# Altium schematic sheet DelSolClock.SchDoc
size A4
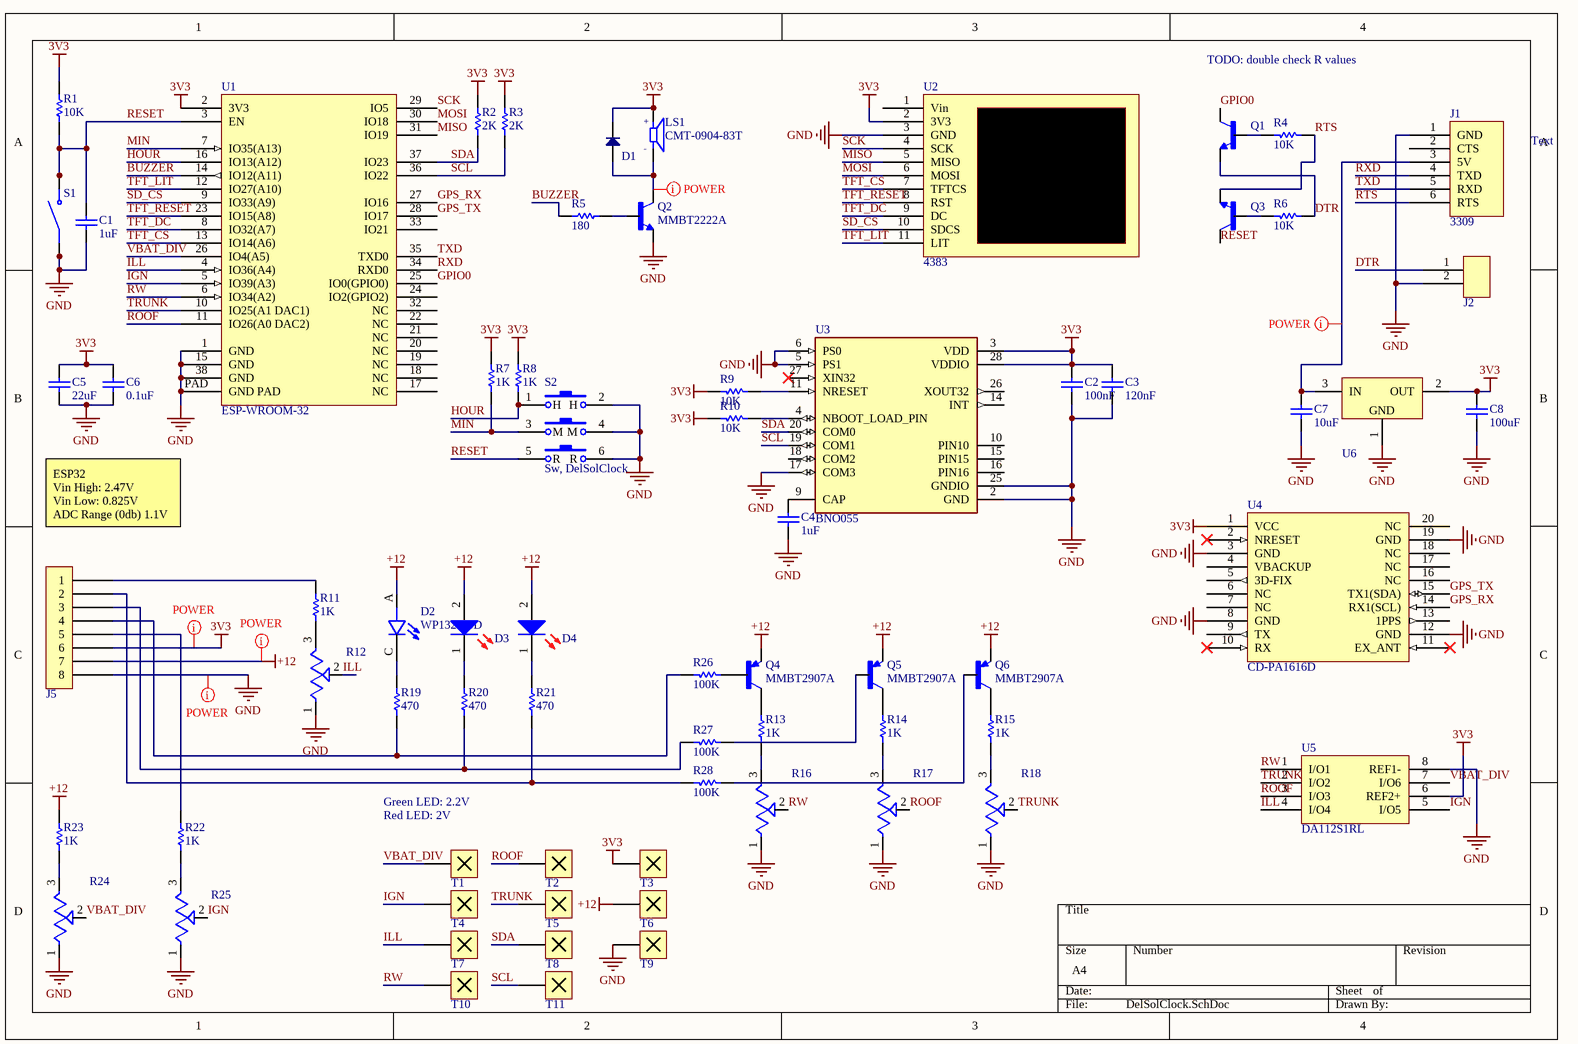
[diagram p0: DelSolClock.SchDoc]

## Parts
C1  value 1uF  [0805 HD - Long]  (hidden comment: CL21B105KOFNNNG)
C2  value 100nF  [0805 HD - Long]  (hidden comment: CL21B104KBCNFNC)
C3  value 120nF  [0805 HD - Long]  (hidden comment: CC0805KRX7R9BB124)
C4  value 1uF  [0805 HD - Long]  (hidden comment: CL21B105KOFNNNG)
C5  value 22uF  [0805 HD - Long]  (hidden comment: Cap)
C6  value 0.1uF  [0805 HD - Long]  (hidden comment: Cap)
C7  value 10uF  [0805 HD - Long]  (hidden comment: Cap)
C8  value 100uF  [0805 HD - Long]  (hidden comment: Cap)
D1  SD0805S020S1R0  [0805 HD - Polarized]  (value not drawn)
D2  WP132XGD  [LEDRD254W50D405H1055]
D3  SSL-LX4673ID-LA20  [LED, SSL-LX4673ID-LA20]  (value not drawn)
D4  SSL-LX4673ID-LA20  [LED, SSL-LX4673ID-LA20]  (value not drawn)
J1  3309  [Conn, 3309]
J2  90120-0122  [CONN, HEADER, 2x1 0.1 Pitch Unshrouded]  (value not drawn)
J5  68000-408HLF  [Conn, Header, 8x1 0.1 Pitch Unshrouded]  (value not drawn)
LS1  CMT-0904-83T  [XDCR_CMT-0904-83T]
Q1  MMBT2222A  [SOT23]  (value not drawn)
Q2  MMBT2222A  [SOT23]
Q3  MMBT2222A  [SOT23]  (value not drawn)
Q4  MMBT2907A  [TRANS_MMBT2907A]
Q5  MMBT2907A  [TRANS_MMBT2907A]
Q6  MMBT2907A  [TRANS_MMBT2907A]
R1  value 10K  [0805 HD - Long]  (hidden comment: RNCP0805FTD10K0)
R2  value 2K  [0805 HD - Long]  (hidden comment: AC0805FR-7W2KL)
R3  value 2K  [0805 HD - Long]  (hidden comment: AC0805FR-7W2KL)
R4  value 10K  [0805 HD - Long]  (hidden comment: RNCP0805FTD10K0)
R5  value 180  [0805 HD - Long]  (hidden comment: ESR10EZPJ181)
R6  value 10K  [0805 HD - Long]  (hidden comment: RNCP0805FTD10K0)
R7  value 1K  [0805 HD - Long]  (hidden comment: CRGH0805J1K0)
R8  value 1K  [0805 HD - Long]  (hidden comment: CRGH0805J1K0)
R9  value 10K  [0805 HD - Long]  (hidden comment: RNCP0805FTD10K0)
R10  value 10K  [0805 HD - Long]  (hidden comment: RNCP0805FTD10K0)
R11  value 1K  [0805 HD - Long]  (hidden comment: CRGH0805J1K0)
R12  PVG3G104C01R00  [TRIM_PVG3G104C01R00]  (value not drawn)
R13  value 1K  [0805 HD - Long]  (hidden comment: CRGH0805J1K0)
R14  value 1K  [0805 HD - Long]  (hidden comment: CRGH0805J1K0)
R15  value 1K  [0805 HD - Long]  (hidden comment: CRGH0805J1K0)
R16  PVG3G104C01R00  [TRIM_PVG3G104C01R00]  (value not drawn)
R17  PVG3G104C01R00  [TRIM_PVG3G104C01R00]  (value not drawn)
R18  PVG3G104C01R00  [TRIM_PVG3G104C01R00]  (value not drawn)
R19  value 470  [0805 HD - Long]  (hidden comment: ESR10EZPJ471)
R20  value 470  [0805 HD - Long]  (hidden comment: ESR10EZPJ471)
R21  value 470  [0805 HD - Long]  (hidden comment: ESR10EZPJ471)
R22  value 1K  [0805 HD - Long]  (hidden comment: CRGH0805J1K0)
R23  value 1K  [0805 HD - Long]  (hidden comment: CRGH0805J1K0)
R24  PVG3G104C01R00  [TRIM_PVG3G104C01R00]  (value not drawn)
R25  PVG3G104C01R00  [TRIM_PVG3G104C01R00]  (value not drawn)
R26  value 100K  [0805 HD - Long]  (hidden comment: CRGH0805J100K)
R27  value 100K  [0805 HD - Long]  (hidden comment: CRGH0805J100K)
R28  value 100K  [0805 HD - Long]  (hidden comment: CRGH0805J100K)
S1  8-1437565-0  [SW_8-1437565-0]  (value not drawn)
S2  Sw, DelSolClock  [Sw, DelSolClock]
T1  Test Point  [5002 Test Point]  (value not drawn)
T2  Test Point  [5002 Test Point]  (value not drawn)
T3  Test Point  [5002 Test Point]  (value not drawn)
T4  Test Point  [5002 Test Point]  (value not drawn)
T5  Test Point  [5002 Test Point]  (value not drawn)
T6  Test Point  [5002 Test Point]  (value not drawn)
T7  Test Point  [5002 Test Point]  (value not drawn)
T8  Test Point  [5002 Test Point]  (value not drawn)
T9  Test Point  [5002 Test Point]  (value not drawn)
T10  Test Point  [5002 Test Point]  (value not drawn)
T11  Test Point  [5002 Test Point]  (value not drawn)
U1  ESP-WROOM-32  [MODULE, ESP32-WROOM-32]
U2  4383  [Module, Adafruit TFT]
U3  BNO055  [LGA28R50P4X10_380X520X100]
U4  CD-PA1616D  [Module, CD-PA1616D]
U5  DA112S1RL  [IC, DA112S1RL]
U6  TLV1117-33CDCYR  [SOT230P700X180-4N Regulator 3.3V 800mA]  (value not drawn)

## Nets
3V3: C2.1 C3.1 C5.2 C6.2 C8.2 D1.1(C) J5.6 LS1.P R1.2 R2.2 R3.2 R7.2 R8.2 R9.1 R10.1 T3.1 U1.2(3V3) U2.2(3V3) U3.3(VDD) U3.28(VDDIO) U4.1(VCC) U5.6(REF2+) U6.2(OUT)
+12: D2.A D3.2(A) D4.2(A) J5.7 Q4.2(E) Q5.2(E) Q6.2(E) R23.1 T6.1
GND: C1.1 C2.2 C3.2 C4.1 C5.1 C6.1 C7.1 C8.1 J1.1(GND) J2.2 J5.8 Q2.2(E) R12.1(CCW) R16.1(CCW) R17.1(CCW) R18.1(CCW) R24.1(CCW) R25.1(CCW) S1.1(COM) S1.2(COM) S2.2(H) S2.4(M) S2.6(R) T9.1 U1.1(GND) U1.15(GND) U1.38(GND) U1.PAD(GND_PAD) U2.3(GND) U3.2(GND) U3.5(PS1) U3.6(PS0) U3.17(COM3) U3.25(GNDIO) U4.3(GND) U4.8(GND) U4.12(GND) U4.19(GND) U5.8(REF1-) U6.1(GND)
BUZZER: R5.1 U1.14(IO12(A11))
DTR: J2.1 Q1.2(E) R6.2
GPIO0: Q1.3(C) U1.25(IO0(GPIO0))
GPS_RX: U1.27(IO16) U4.14(RX1(SCL))
GPS_TX: U1.28(IO17) U4.15(TX1(SDA))
HOUR: R8.1 S2.1(H) U1.16(IO13(A12))
IGN: R25.2(WIPER) T4.1 U1.5(IO39(A3)) U5.5(I/O5)
ILL: R12.2(WIPER) T7.1 U1.4(IO36(A4)) U5.4(I/O4)
MIN: R7.1 S2.3(M) U1.7(IO35(A13))
MISO: U1.31(IO19) U2.5(MISO)
MOSI: U1.30(IO18) U2.6(MOSI)
RESET: C1.2 Q3.3(C) R1.1 S1.3(NO) S1.4(NO) S2.5(R) U1.3(EN)
ROOF: R17.2(WIPER) T2.1 U1.11(IO26(A0_DAC2)) U5.3(I/O3)
RTS: J1.6(RTS) Q3.2(E) R4.2
RW: R16.2(WIPER) T10.1 U1.6(IO34(A2)) U5.1(I/O1)
RXD: J1.4(TXD) U1.34(RXD0)
SCK: U1.29(IO5) U2.4(SCK)
SCL: R3.1 T11.1 U1.36(IO22) U3.19(COM1)
SD_CS: U1.9(IO33(A9)) U2.10(SDCS)
SDA: R2.1 T8.1 U1.37(IO23) U3.20(COM0)
TFT_CS: U1.13(IO14(A6)) U2.7(TFTCS)
TFT_DC: U1.8(IO32(A7)) U2.9(DC)
TFT_LIT: U1.12(IO27(A10)) U2.11(LIT)
TFT_RESET: U1.23(IO15(A8)) U2.8(RST)
TRUNK: R18.2(WIPER) T5.1 U1.10(IO25(A1_DAC1)) U5.2(I/O2)
TXD: J1.5(RXD) U1.35(TXD0)
VBAT_DIV: R24.2(WIPER) T1.1 U1.26(IO4(A5)) U5.7(I/O6)
NetC4_2: C4.2 U3.9(CAP)
NetC7_2: C7.2 J1.3(5V) U6.3(IN)
NetD1_2: D1.2(A) LS1.N Q2.3(C)
NetD2_C: D2.C R19.2
NetD3_1: D3.1(K) R20.2
NetD4_1: D4.1(K) R21.2
NetJ5_1: J5.1 R11.2
NetJ5_2: J5.2 R21.1 R28.1
NetJ5_3: J5.3 R20.1 R27.1
NetJ5_4: J5.4 R19.1 R26.1
NetJ5_5: J5.5 R22.1
NetQ1_1: Q1.1(B) R4.1
NetQ2_1: Q2.1(B) R5.2
NetQ3_1: Q3.1(B) R6.1
NetQ4_1: Q4.1(B) R26.2
NetQ4_3: Q4.3(C) R13.2
NetQ5_1: Q5.1(B) R27.2
NetQ5_3: Q5.3(C) R14.2
NetQ6_1: Q6.1(B) R28.2
NetQ6_3: Q6.3(C) R15.2
NetR9_2: R9.2 U3.11(NRESET)
NetR10_2: R10.2 U3.4(NBOOT_LOAD_PIN)
NetR11_1: R11.1 R12.3(CW)
NetR13_1: R13.1 R16.3(CW)
NetR14_1: R14.1 R17.3(CW)
NetR15_1: R15.1 R18.3(CW)
NetR22_2: R22.2 R25.3(CW)
NetR23_2: R23.2 R24.3(CW)

Not connected (* = marked no-connect by the designer): J1 2(CTS); U1 17(NC) 18(NC) 19(NC) 20(NC) 21(NC) 22(NC) 24(IO2(GPIO2)) 32(NC) 33(IO21); U2 1(Vin); U3 10(PIN10) 14(INT) 15(PIN15) 16(PIN16) 18(COM2) 26(XOUT32) 27(XIN32)*; U4 2(NRESET)* 4(VBACKUP) 5(3D-FIX) 6(NC) 7(NC) 9(TX) 10(RX)* 11(EX_ANT)* 13(1PPS) 16(NC) 17(NC) 18(NC) 20(NC)

## Layout directives
net class POWER: 3V3, +12, GND, NetC7_2, NetD1_2

## Notes on the sheet
- TODO: double check R values
- Text
- ESP32
  Vin High: 2.47V
  Vin Low: 0.825V
  ADC Range (0db) 1.1V
- Green LED: 2.2V
- (near T1) Red LED: 2V
- (in symbol CMT-0904-83T) +; -

## Library data of the parts
C1-C8 = Cap: Capacitor
  C1 C4: MFGPN: CL21B105KOFNNNG
  C2: MFGPN: CL21B104KBCNFNC
  C3: MFGPN: CC0805KRX7R9BB124
D1 = Diode: DST: Digikey; MFG: Panasonic - ECG; DSTPN: *; ESTCOST: *; MFGPN: *
D2 = WP132XGD: Green 568nm LED Indication - Discrete 2.2V Radial; MF: {'manufacturer': u'Kingbright'}; Value: *; Availability: Unavailable; Price: None; Package: None; MP: WP132XGD
D3 D4 = LED, SSL-LX4673ID-LA20: LED, Red, 20mA, through hole, rectangular, 2V; MFG: Lumex Opto/Components Inc.; DSTPN: 67-1083-ND; DST: Digikey; ESTCOST: 1.03; MFGPN: SSL-LX4673ID-LA20
J1 = Conn, 3309: Conn, Serial USB Adafruit CP2104 Friend; ESTCOST: 5.95; MFG: Adafruit; MFGPN: 3309; DST: Adafruit; DSTPN: 3309
J2 = Conn, 90120-0122: Header, 2x1 0.1" Unshrouded Tin; DST: Digikey; DSTPN: WM8072-ND; ESTCOST: 0.121; MFG: Molex Connector Corporation; MFGPN: 90120-0122; Supplier 1: Digi-Key; Supplier Part Number 1: WM8072-ND
J5 = Conn, 68000-408HLF: Header, 8x1 0.1" Unshrouded Tin; DST: Digikey; DSTPN: 609-3264-ND; ESTCOST: .149; MFG: FCI; MFGPN: 68000-408HLF
LS1 = CMT-0904-83T: MF: {'manufacturer': u'CUI Devices'}; Package: None; MP: CMT-0904-83T; Price: None; Value: *; Availability: Unavailable
Q1-Q3 = MMBT2222A: <h3>2N2222 General Purpose NPN Transistor</h3>; MF: {'manufacturer': u'ON Semiconductor'}; Package: None; MP: MMBT2222A; Price: None; Value: *; Availability: Unavailable
Q4-Q6 = MMBT2907A: 350mW, PNP Small Signal Transistor; MF: {'manufacturer': u'STMicroelectronics'}; Value: *; MP: MMBT2907A; Package: None; Availability: Unavailable; Price: None
R1-R11 R13-R15 R19-R23 R26-R28 = Res: Resistor
  R1 R4 R6 R9 R10: MFGPN: RNCP0805FTD10K0
  R2 R3: MFGPN: AC0805FR-7W2KL
  R5: MFGPN: ESR10EZPJ181
  R7 R8 R11 R13-R15 R22 R23: MFGPN: CRGH0805J1K0
  R19-R21: MFGPN: ESR10EZPJ471
  R26-R28: MFGPN: CRGH0805J100K
R12 R24 R25 = PVG3G104C01R00: 100 kOhms 0.25W, 1/4W Gull Wing Surface Mount Trimmer Potentiometer Cermet 1 Turn Top Adjustment; MF: {'manufacturer': u'Bourns'}; Package: None; MP: PVG3G104C01R00; Price: None; Value: *; Availability: Unavailable
R16-R18 = PVG3G104C01R00: 10 kOhms 0.25W, 1/4W Gull Wing Surface Mount Trimmer Potentiometer Cermet 1 Turn Top Adjustment; MF: {'manufacturer': u'Bourns'}; Package: None; MP: PVG3G104C01R00; Price: None; Value: *; Availability: Unavailable
S1 = 8-1437565-0: MF: {'manufacturer': u'TE Connectivity'}; Package: None; MP: 8-1437565-0; Price: None; Value: *; Availability: Unavailable
S2 = Sw, DelSolClock: Switch, Del Sol Clock, elastomeric
T1-T11 = Test Point: DST: Digikey; DSTPN: 5002K-ND; ESTCOST: .293; MFG: Keystone Electronics; MFGPN: 5002
U1 = Module, ESP-WROOM-32: Module, Wifi Module, ESP32 4MB Flash 520K RAM; MFG: Espressif; DST: Adafruit; ESTCOST: 8.95; DSTPN: 3320; MFGPN: ESP-WROOM-32
U2 = Module, Adafruit TFT: Module, Display, Graphic TFT 240x135 Color, ST7789; ESTCOST: 14.95; MFG: Adafruit; MFGPN: 4383; DST: Adafruit; DSTPN: 4383
U3 = BNO055: BNO055 9-axis Absolute Orientation Sensor ( SiP ) w/Sensors and Sensor Fusion; MF: {'manufacturer': u'Bosch'}; Package: None; MP: BNO055; Price: None; Value: *; Availability: Unavailable
U4 = Module, CD-PA1616D: Module, GPS, module with integrated antenna; MFG: CD Technology; DST: Adafruit; DSTPN: 5186; ESTCOST: 19.95; MFGPN: CD-PA1616D
U5 = IC, DA112S1RL: IC, TVS Diode, 6 channel
U6 = IC, TLV1117-33CDCYR: IC, Regulator 3.3V 800mA LDO 15V max SOT-223; DST: Digikey; DSTPN: 296-21112-1-ND; ESTCOST: 0.480; MFG: Texas Instruments; MFGPN: TLV1117-33CDCYR